# EAGLE design drv592 (EAGLE 8.0.0)
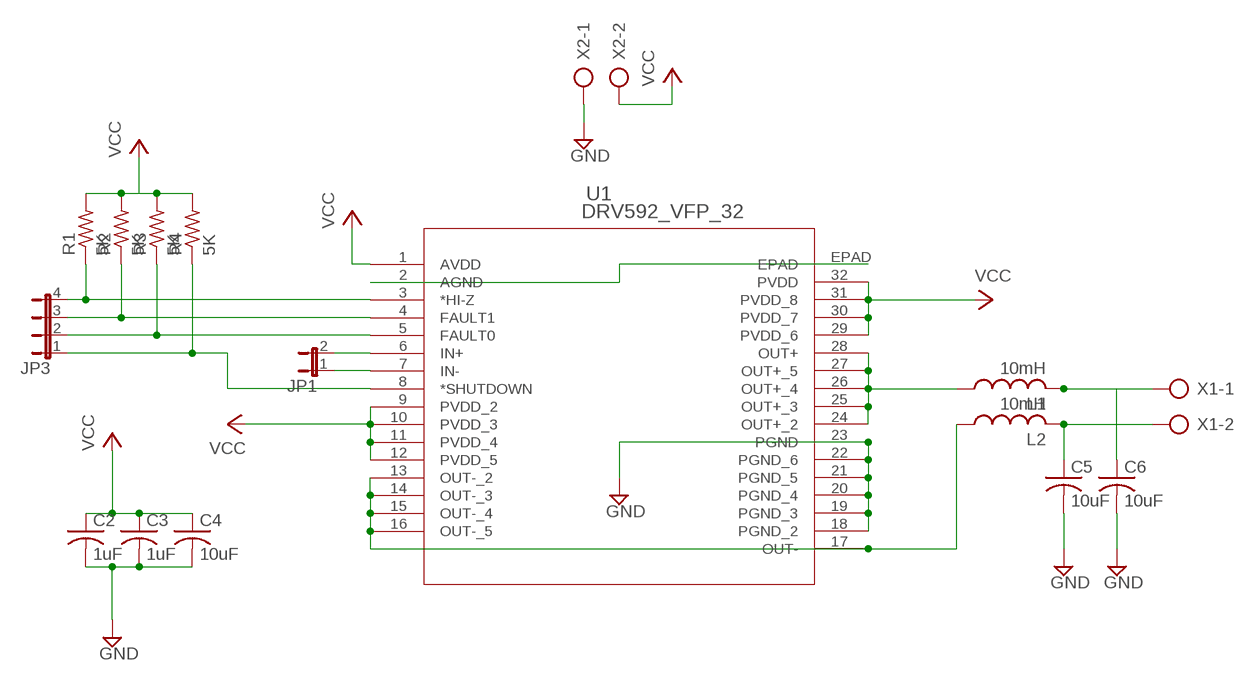
[diagram p0: schematic, sheet 1]

## Parts
C2  1uF  C-US050-030X075  [C050-030X075]
C3  1uF  C-US050-030X075  [C050-030X075]
C4  10uF  C-US050-030X075  [C050-030X075]
C5  10uF  C-US050-030X075  [C050-030X075]
C6  10uF  C-US050-030X075  [C050-030X075]
JP1  JP1E  [JP1]
JP3  JP4E  [JP4]
L1  10mH  L-USTJ3-U2  [TJ3-U2]
L2  10mH  L-USTJ3-U2  [TJ3-U2]
R1  5K  R-US_0207/10  [0207/10]
R2  5K  R-US_0207/10  [0207/10]
R3  5K  R-US_0207/10  [0207/10]
R4  5K  R-US_0207/10  [0207/10]
U1  DRV592_VFP_32  [VFP32_3P91X3P91]
X1  AK300/2  [AK300/2]
X2  AK300/2  [AK300/2]

## Nets
GND: C2.2 C3.2 C4.2 C5.2 C6.2 U1.18(PGND_2) U1.19(PGND_3) U1.20(PGND_4) U1.21(PGND_5) U1.22(PGND_6) U1.23(PGND) X2.1
N$1: L1.1 U1.24(OUT+_2) U1.25(OUT+_3) U1.26(OUT+_4) U1.27(OUT+_5) U1.28(OUT+)
N$2: C5.1 L2.2 X1.2
N$3: L2.1 U1.13(OUT-_2) U1.14(OUT-_3) U1.15(OUT-_4) U1.16(OUT-_5) U1.17(OUT-)
N$4: C6.1 L1.2 X1.1
N$5: JP1.2 U1.6(IN+)
N$6: JP1.1 U1.7(IN-)
N$7: JP3.4 R1.1 U1.3(*HI-Z)
N$8: JP3.3 R2.1 U1.4(FAULT1)
N$9: JP3.2 R3.1 U1.5(FAULT0)
N$10: JP3.1 R4.1 U1.8(*SHUTDOWN)
N$11: U1.2(AGND) U1.EPAD
VCC: C2.1 C3.1 C4.1 R1.2 R2.2 R3.2 R4.2 U1.1(AVDD) U1.9(PVDD_2) U1.10(PVDD_3) U1.11(PVDD_4) U1.12(PVDD_5) U1.29(PVDD_6) U1.30(PVDD_7) U1.31(PVDD_8) U1.32(PVDD) X2.2

## Library data of the parts
C2-C6 = resistor:C-US: CAPACITOR, American symbol
JP1 = jumper:JP1E: JUMPER
JP3 = jumper:JP4E: JUMPER
L1 L2 = resistor:L-US: INDUCTOR, American symbol
R1-R4 = resistor:R-US_: RESISTOR, American symbol
U1 = DRV592:DRV592_VFP_32; DATASHEETURL: httpwww.ti.comlitgpnDRV592; FAMILY_NAME: PWM POWER DRIVER; GENERIC_PART_NUMBER: DRV592; INDUSTRY_STD_PKG_TYPE: HLQFP; MANUFACTURER: Texas Instruments; MANUFACTURER_PART_NUMBER: drv592_vfp_32; PACKAGE_DESIGNATOR: VFP; PIN_COUNT: 32; VENDOR: Texas Instruments
X1 X2 = con-ptr500:AK300/2: CONNECTOR; OC_FARNELL: unknown; OC_NEWARK: unknown

## Net classes
0 default: width 0.406 mm, drill 0.762 mm, clearance 0.508 mm

## Board
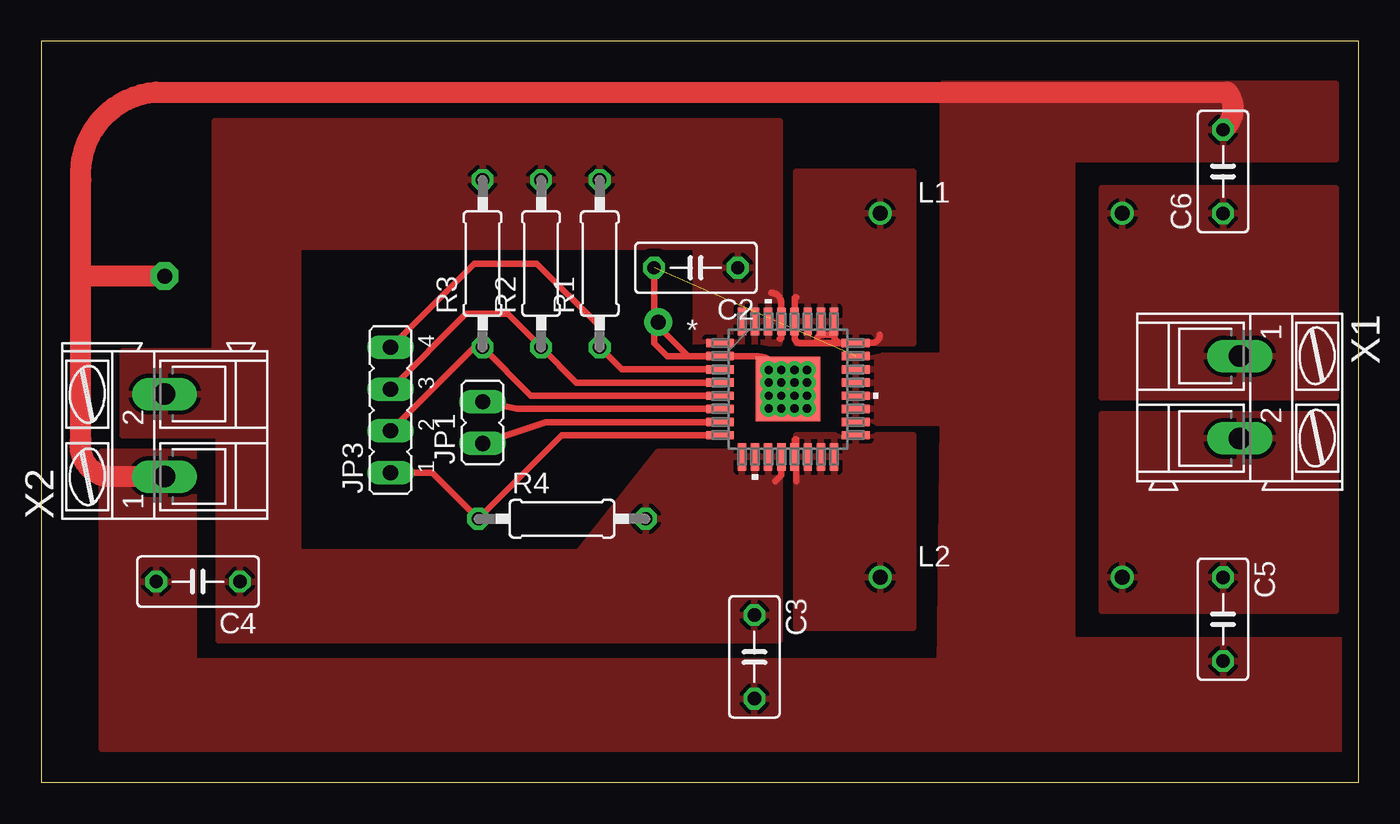
[diagram p1: board, top side]
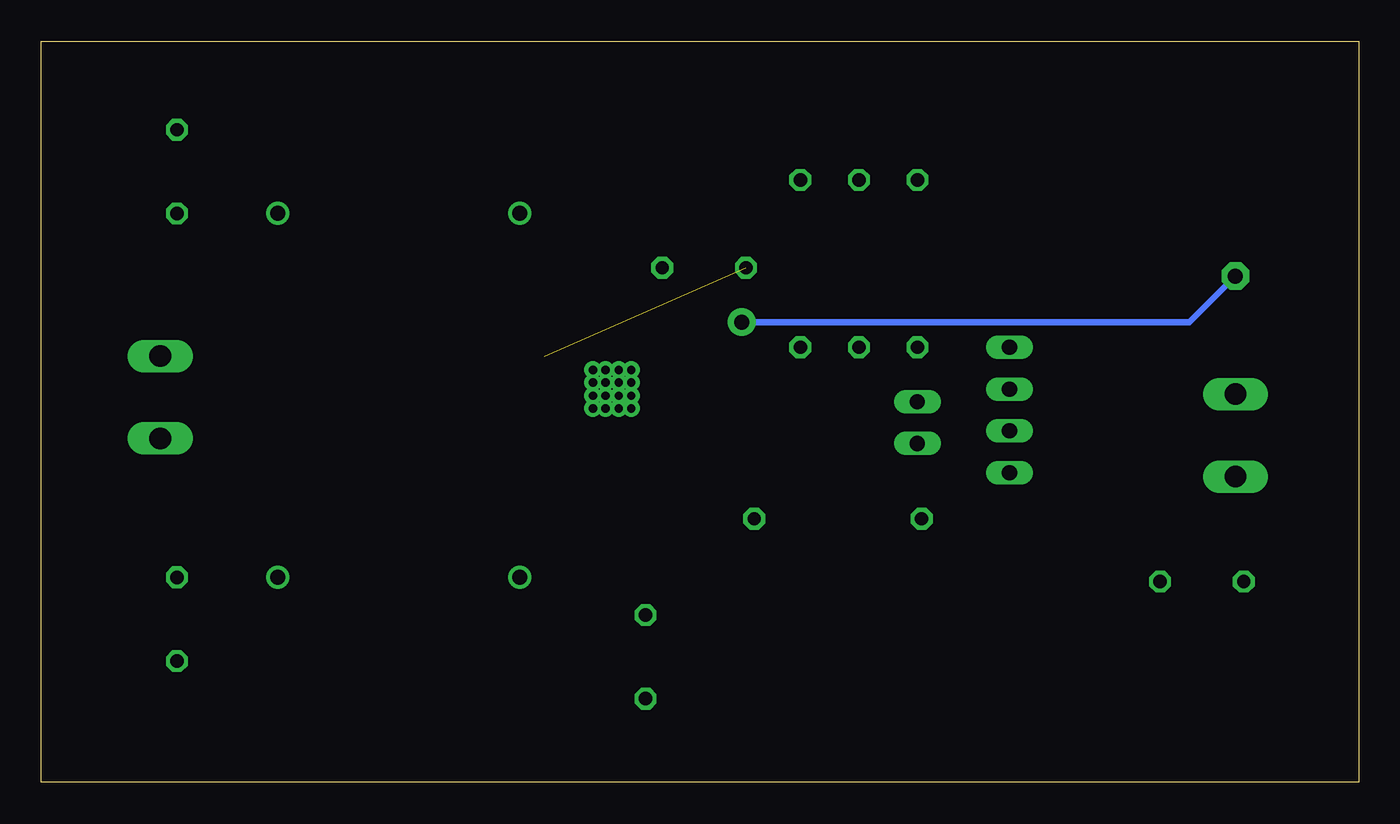
[diagram p2: board, bottom side, seen from below]

Size 80 x 45 mm. Coordinates in mm from the lower left corner, seen from the top.
Outline: 0,0 80,0 80,45 0,45 0,0
Copper layers (1*16): Top 0.035mm / dielectric 1.5mm / Bottom 0.035mm
Design rules "default *": minimum track width 16mil, minimum drill 30mil, track to track 16mil, track to pad 16mil, pad to pad 16mil, via to via 16mil, smd to smd 8mil, copper to edge 40mil, drill to drill 30mil, minimum pad ring 10mil, minimum via ring 8mil, stop-mask expansion 4mil, vias tented up to drill 0mil, thermal gap 10mil

### Footprints (pad centres in the part's own frame; a part is rotated, then mirrored left to right if it is on the bottom)
C050-030X075 = drill 0.813 octagon: 1 -2.54,0; 2 2.54,0
JP1 = drill 0.914 long: 1 0,-1.27; 2 0,1.27
JP4 = drill 0.914 long: 1 -3.81,0; 2 -1.27,0; 3 1.27,0; 4 3.81,0
TJ3-U2 = drill 0.9: 1 -7.35,0; 2 7.35,0
0207/10 = drill 0.813 octagon: 1 -5.08,0; 2 5.08,0
VFP32_3P91X3P91 = smd 1.676 x 0.508: 1 -4.115,2.8; 2 -4.115,2; 3 -4.115,1.2; 4 -4.115,0.4; 5 -4.115,-0.4; 6 -4.115,-1.2; 7 -4.115,-2; 8 -4.115,-2.8; 17 4.115,-2.8; 18 4.115,-2; 19 4.115,-1.2; 20 4.115,-0.4; 21 4.115,0.4; 22 4.115,1.2; 23 4.115,2; 24 4.115,2.8 | smd 0.508 x 1.676: 9 -2.8,-4.115; 10 -2,-4.115; 11 -1.2,-4.115; 12 -0.4,-4.115; 13 0.4,-4.115; 14 1.2,-4.115; 15 2,-4.115; 16 2.8,-4.115; 25 2.8,4.115; 26 2,4.115; 27 1.2,4.115; 28 0.4,4.115; 29 -0.4,4.115; 30 -1.2,4.115; 31 -2,4.115; 32 -2.8,4.115 | smd 3.91 x 3.91: EPAD 0,0 | drill 0.508 pad 1.016: V -1.168,-1.168; V_1 -1.168,-0.406; V_2 -1.168,0.406; V_3 -1.168,1.168; V_4 -0.406,-1.168; V_5 -0.406,-0.406; V_6 -0.406,0.406; V_7 -0.406,1.168; V_8 0.406,-1.168; V_9 0.406,-0.406; V_10 0.406,0.406; V_11 0.406,1.168; V_12 1.168,-1.168; V_13 1.168,-0.406; V_14 1.168,0.406; V_15 1.168,1.168
AK300/2 = drill 1.321 long: 1 -2.515,0; 2 2.489,0

### Placement (x,y rotation side)
C2  39.75,31.24 180 top
C3  43.31,7.62 270 top
C4  9.53,12.19 180 top
C5  71.75,9.91 270 top
C6  71.75,37.08 90 top
JP1  26.8,21.84 0 top
JP3  21.21,22.61 90 top
L1  58.29,34.54 0 top
L2  58.29,12.45 0 top
R1  33.91,31.5 90 top
R2  30.35,31.5 90 top
R3  26.8,31.5 90 top
R4  31.62,16 0 top
U1  45.34,23.88 0 top
X1  72.77,23.37 270 top
X2  7.49,21.08 90 top

### Tracks (layer width: path | path; a pad name or v marks a point on that pad's centre or on a via)
GND  (1 unrouted)
  Top 1.27: X2.1 3.91,18.57 arc-90 2.41,20.83 2.41,36.58 arc-90 6.99,41.91 72.01,41.91 arc-90 C6.2
  pour Top: 62.61,2.03 62.61,25.91 48.9,25.91 48.9,21.84 54.74,21.84 54.48,2.03
  pour Top: 62.1,8.64 62.1,2.03 78.87,2.03 78.87,8.64
  pour Top: 3.68,20.07 9.27,20.07 9.27,7.37 65.15,7.37 65.41,2.03 3.68,2.03
  pour Top: 54.74,21.84 62.61,21.84 62.61,37.85 78.61,37.85 78.61,42.42 54.74,42.42
N$1
  Top 0.406: 45.85,29.46 arc90 45.74,29.36 U1.28 45.74,27.03 arc90 46.1,26.67 48.64,26.67 | 48.9,26.67 48.64,26.67 | 48.64,26.67 arc-90 48.13,27.18 47.37,27.18 arc90 47.12,26.92 | U1.24 50.42,26.68 arc90 50.93,27.18
  pour Top: 45.85,26.67 45.85,37.08 52.96,37.08 52.96,26.67
N$2
  pour Top: 78.61,22.35 78.61,10.41 64.39,10.41 64.39,22.35
N$3
  Top 0.406: U1.13 45.74,20.72 arc-90 45.85,20.83 45.85,18.29
  pour Top: 45.85,21.08 45.85,9.4 52.96,9.4 52.96,21.08
N$4
  pour Top: 64.39,36.07 64.39,23.37 78.61,23.37 78.61,36.07
N$5
  Top 0.406: JP1.2 28.9,22.68 U1.6
N$6
  Top 0.406: JP1.1 30.64,21.88 U1.7
N$7
  Top 0.406: JP3.4 26.29,31.5 30.1,31.5 33.91,27.69 R1.1 35.25,25.08 U1.3
N$8
  Top 0.406: JP3.3 25.78,28.45 28.32,28.45 R2.1 32.49,24.28 U1.4
N$9
  Top 0.406: JP3.2 26.29,26.42 R3.1 29.74,23.48 U1.5
N$10
  Top 0.406: U1.8 31.62,21.08 R4.1 23.75,18.8 JP3.1
N$11
  Top 0.406: U1.2 43.34,25.88 arc-90 U1.EPAD | U1.2 39.27,25.88 37.47,27.69 | U1.2 38.01,25.88 37.21,26.67 37.21,31.24
N$12  (via drill 0.9 pad 1.68)
  Bottom 0.406: v37.47,27.94 26.04,27.94
N$14  (via drill 0.9 pad 1.68)
  Top 1.27: v7.49,30.73 2.41,30.73
  Bottom 0.406: v7.49,30.73 10.29,27.94 37.47,27.94
VCC
  Top 0.406: 44.32,29.72 arc-90 44.94,29.1 U1.29 44.94,27.03 arc-90 44.83,26.92 | U1.12 44.94,18.65 44.58,18.29
  pour Top: 10.54,21.59 15.62,21.59 15.62,32.51 39.75,32.51 39.75,26.67 44.83,26.67 44.83,40.13 10.54,40.13
  pour Top: 10.79,8.64 44.83,8.64 44.83,20.07 37.47,20.07 32.64,13.97 10.79,13.97
  pour Top: 4.95,26.16 4.95,21.08 15.37,21.08 15.37,26.16
  pour Top: 10.79,8.64 15.62,8.64 15.62,25.15 10.79,25.15